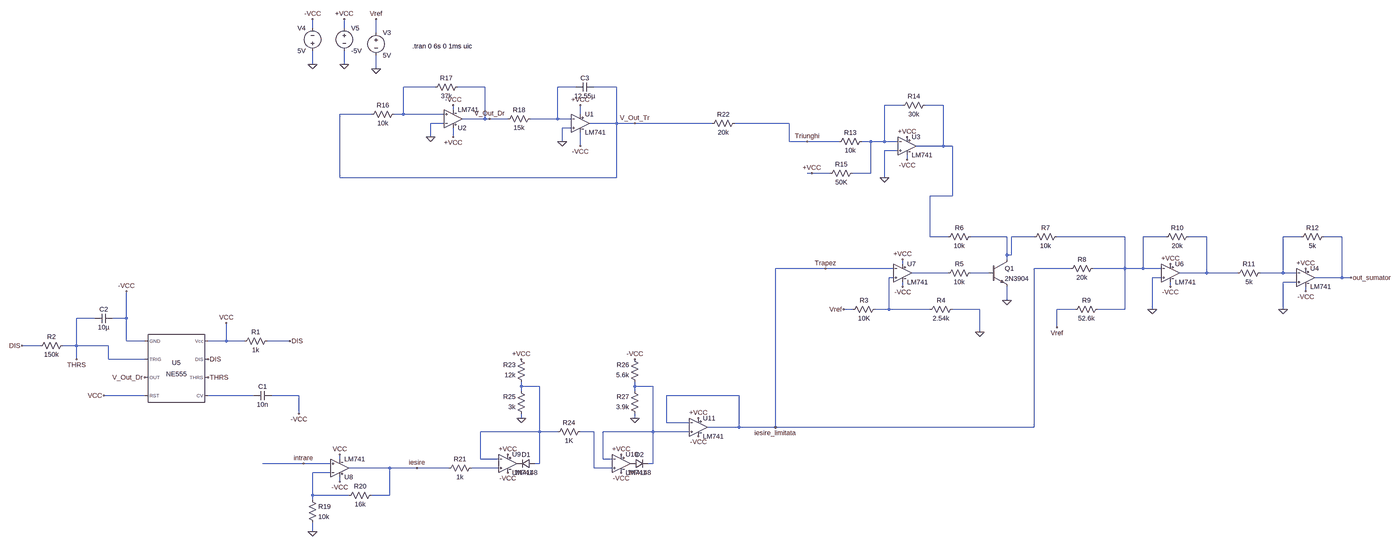
[diagram p0: schematic PROIECTSCIAIII_tot.asc, whole sheet]
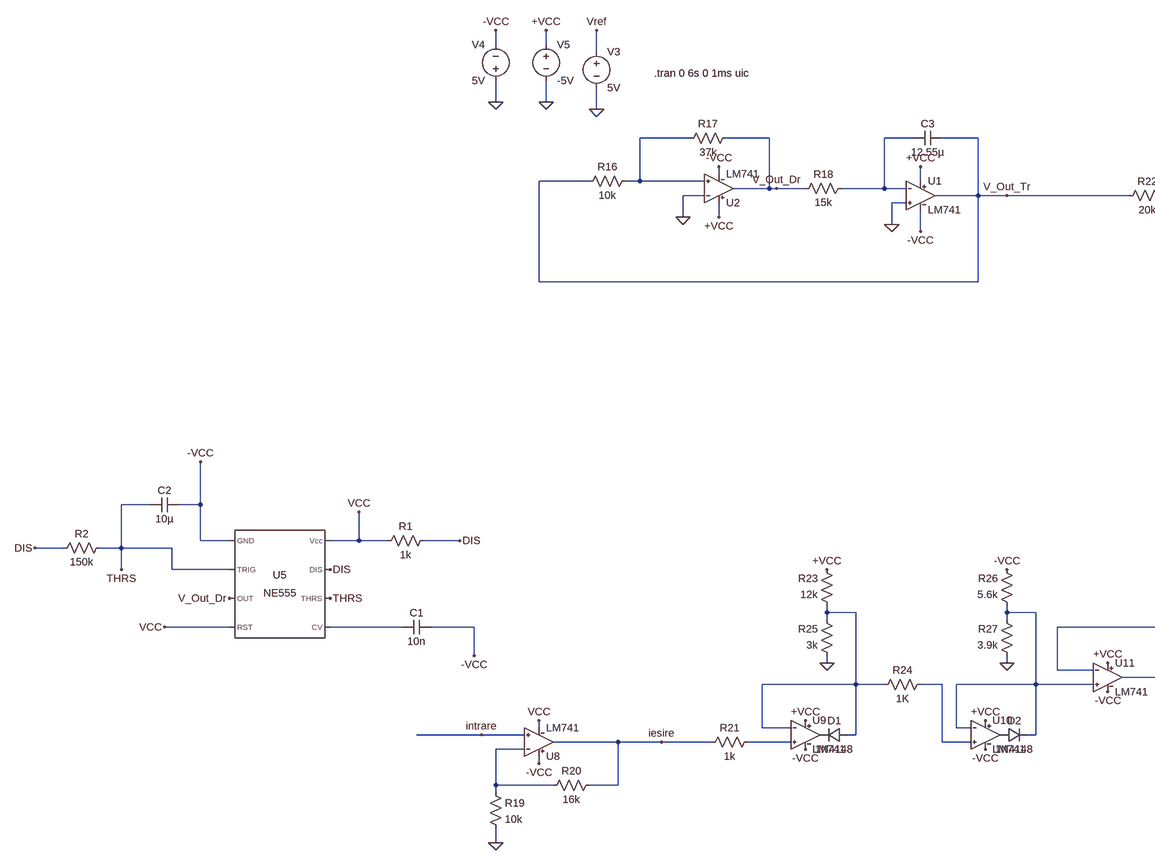
[diagram p1: schematic PROIECTSCIAIII_tot.asc, part, row 1 of 1, column 1 of 2]
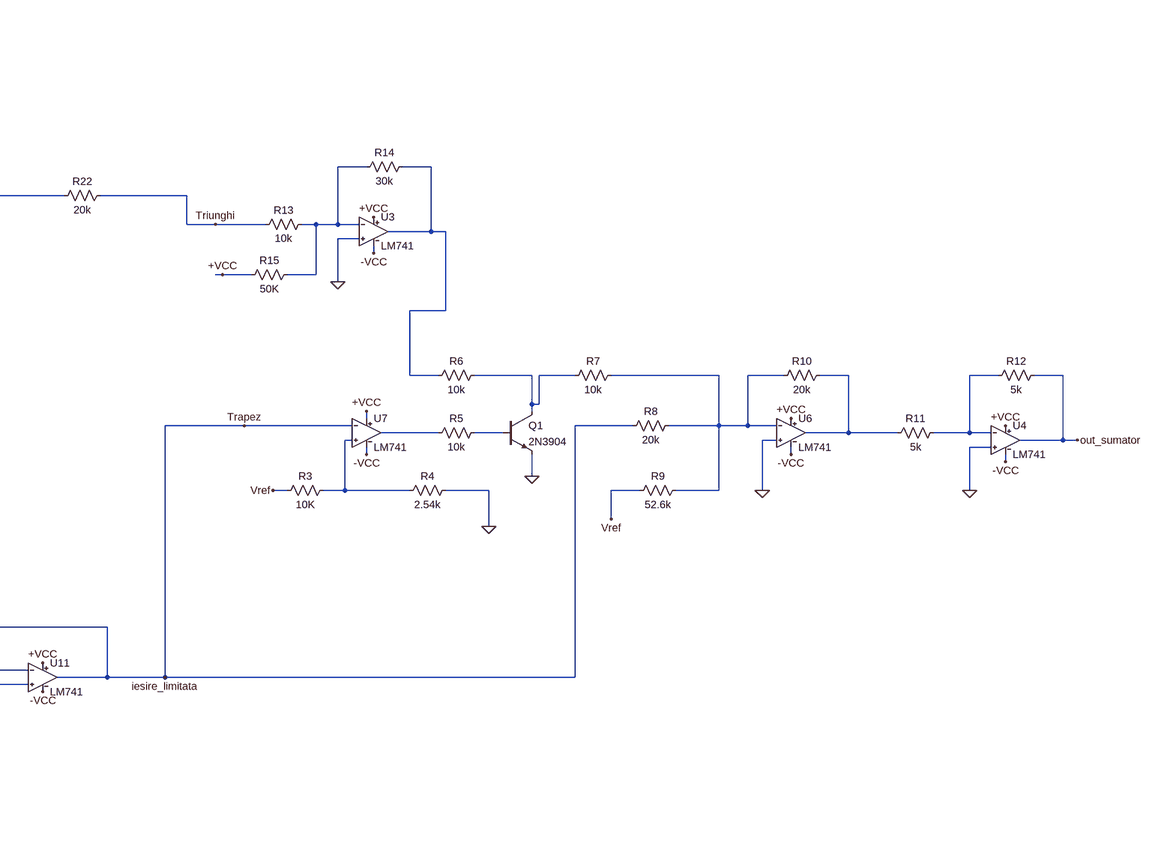
[diagram p2: schematic PROIECTSCIAIII_tot.asc, part, row 1 of 1, column 2 of 2]
PROIECTSCIAIII_tot.asc, the LTspice schematic file:
Version 4.1
SHEET 1 5364 2244
WIRE 1408 -1088 1408 -1120
WIRE 1520 -1088 1520 -1120
WIRE 1632 -1072 1632 -1120
WIRE 1408 -960 1408 -1008
WIRE 1520 -960 1520 -1008
WIRE 1632 -944 1632 -992
WIRE 1840 -880 1728 -880
WIRE 2016 -880 1920 -880
WIRE 2336 -880 2272 -880
WIRE 2480 -880 2400 -880
WIRE 3488 -816 3424 -816
WIRE 3632 -816 3568 -816
WIRE 1904 -800 1904 -816
WIRE 1616 -784 1504 -784
WIRE 1728 -784 1728 -880
WIRE 1728 -784 1696 -784
WIRE 1872 -784 1728 -784
WIRE 2352 -784 2352 -816
WIRE 2016 -768 2016 -880
WIRE 2016 -768 1936 -768
WIRE 2032 -768 2016 -768
WIRE 2096 -768 2032 -768
WIRE 2272 -768 2272 -880
WIRE 2272 -768 2176 -768
WIRE 2320 -768 2272 -768
WIRE 1872 -752 1824 -752
WIRE 2480 -752 2480 -880
WIRE 2480 -752 2384 -752
WIRE 2544 -752 2480 -752
WIRE 2816 -752 2544 -752
WIRE 3088 -752 2896 -752
WIRE 2320 -736 2288 -736
WIRE 1824 -704 1824 -752
WIRE 1904 -704 1904 -736
WIRE 2288 -688 2288 -736
WIRE 3088 -688 3088 -752
WIRE 3152 -688 3088 -688
WIRE 3264 -688 3152 -688
WIRE 3376 -688 3344 -688
WIRE 3424 -688 3424 -816
WIRE 3424 -688 3376 -688
WIRE 3472 -688 3424 -688
WIRE 2352 -672 2352 -720
WIRE 3632 -672 3632 -816
WIRE 3632 -672 3536 -672
WIRE 3664 -672 3632 -672
WIRE 3472 -656 3424 -656
WIRE 3504 -624 3504 -640
WIRE 3168 -576 3152 -576
WIRE 3232 -576 3168 -576
WIRE 3376 -576 3376 -688
WIRE 3376 -576 3312 -576
WIRE 1504 -560 1504 -784
WIRE 2480 -560 2480 -752
WIRE 2480 -560 1504 -560
WIRE 3424 -560 3424 -656
WIRE 3664 -496 3664 -672
WIRE 3664 -496 3584 -496
WIRE 3584 -352 3584 -496
WIRE 3648 -352 3584 -352
WIRE 3856 -352 3728 -352
WIRE 3952 -352 3872 -352
WIRE 4272 -352 4032 -352
WIRE 4416 -352 4336 -352
WIRE 4560 -352 4496 -352
WIRE 5008 -352 4944 -352
WIRE 5152 -352 5088 -352
WIRE 3856 -288 3856 -352
WIRE 3872 -288 3872 -352
WIRE 3872 -288 3856 -288
WIRE 3856 -272 3856 -288
WIRE 3488 -256 3488 -272
WIRE 3216 -240 3040 -240
WIRE 3456 -240 3216 -240
WIRE 4080 -240 3952 -240
WIRE 4272 -240 4272 -352
WIRE 4272 -240 4160 -240
WIRE 4336 -240 4336 -352
WIRE 4336 -240 4272 -240
WIRE 4400 -240 4336 -240
WIRE 3648 -224 3520 -224
WIRE 3792 -224 3728 -224
WIRE 4560 -224 4560 -352
WIRE 4560 -224 4464 -224
WIRE 4784 -224 4560 -224
WIRE 4944 -224 4944 -352
WIRE 4944 -224 4864 -224
WIRE 4992 -224 4944 -224
WIRE 3456 -208 3440 -208
WIRE 4400 -208 4368 -208
WIRE 5152 -208 5152 -352
WIRE 5152 -208 5056 -208
WIRE 5184 -208 5152 -208
WIRE 4992 -192 4944 -192
WIRE 3488 -176 3488 -192
WIRE 4432 -176 4432 -192
WIRE 5024 -160 5024 -176
WIRE 3856 -128 3856 -176
WIRE 3312 -96 3280 -96
WIRE 3440 -96 3440 -208
WIRE 3440 -96 3392 -96
WIRE 3584 -96 3440 -96
WIRE 3760 -96 3664 -96
WIRE 4096 -96 4032 -96
WIRE 4272 -96 4272 -240
WIRE 4272 -96 4176 -96
WIRE 4368 -96 4368 -208
WIRE 4944 -96 4944 -192
WIRE 640 -64 576 -64
WIRE 752 -64 752 -160
WIRE 752 -64 704 -64
WIRE 4032 -32 4032 -96
WIRE 3760 -16 3760 -96
WIRE 752 16 752 -64
WIRE 816 16 752 16
WIRE 1104 16 1104 -48
WIRE 1104 16 1040 16
WIRE 1168 16 1104 16
WIRE 1328 16 1248 16
WIRE 448 32 384 32
WIRE 576 32 576 -64
WIRE 576 32 528 32
WIRE 688 32 576 32
WIRE 576 80 576 32
WIRE 688 80 688 32
WIRE 816 80 688 80
WIRE 2144 176 2144 160
WIRE 2208 176 2144 176
WIRE 2544 176 2544 160
WIRE 2608 176 2544 176
WIRE 2144 192 2144 176
WIRE 2544 192 2544 176
WIRE 816 208 672 208
WIRE 1200 208 1040 208
WIRE 1360 208 1264 208
WIRE 2912 208 2656 208
WIRE 1360 272 1360 208
WIRE 2144 288 2144 272
WIRE 2544 288 2544 272
WIRE 2656 304 2656 208
WIRE 2736 304 2656 304
WIRE 2912 320 2912 208
WIRE 2912 320 2800 320
WIRE 3040 320 3040 -240
WIRE 3040 320 2912 320
WIRE 3952 320 3952 -240
WIRE 3952 320 3040 320
WIRE 2208 336 2208 176
WIRE 2208 336 2000 336
WIRE 2272 336 2208 336
WIRE 2400 336 2352 336
WIRE 2608 336 2608 176
WIRE 2608 336 2432 336
WIRE 2736 336 2608 336
WIRE 1504 432 1504 416
WIRE 2000 432 2000 336
WIRE 2064 432 2000 432
WIRE 2432 432 2432 336
WIRE 2464 432 2432 432
WIRE 1376 448 1232 448
WIRE 1472 448 1376 448
WIRE 2208 448 2208 336
WIRE 2208 448 2192 448
WIRE 2608 448 2608 336
WIRE 2608 448 2592 448
WIRE 1680 464 1536 464
WIRE 1776 464 1680 464
WIRE 1888 464 1776 464
WIRE 2064 464 1968 464
WIRE 2400 464 2400 336
WIRE 2464 464 2400 464
WIRE 1472 480 1408 480
WIRE 1504 512 1504 496
WIRE 1408 560 1408 480
WIRE 1536 560 1408 560
WIRE 1680 560 1680 464
WIRE 1680 560 1616 560
WIRE 1408 576 1408 560
WIRE 1408 688 1408 656
FLAG 1360 272 -VCC
FLAG 672 208 VCC
FLAG 816 144 V_Out_Dr
FLAG 1040 80 DIS
FLAG 1040 144 THRS
FLAG 1328 16 DIS
FLAG 1104 -48 VCC
FLAG 384 32 DIS
FLAG 576 80 THRS
FLAG 3760 -16 0
FLAG 3856 -128 0
FLAG 3488 -272 +VCC
FLAG 3488 -176 -VCC
FLAG 4368 -96 0
FLAG 4944 -96 0
FLAG 4432 -176 -VCC
FLAG 4432 -256 +VCC
FLAG 5024 -240 +VCC
FLAG 5024 -160 -VCC
FLAG 3280 -96 Vref
FLAG 1632 -1120 Vref
FLAG 1632 -944 0
FLAG 1408 -960 0
FLAG 1408 -1120 -VCC
FLAG 1520 -960 0
FLAG 1520 -1120 +VCC
FLAG 3216 -240 Trapez
FLAG 5184 -208 out_sumator
FLAG 3424 -560 0
FLAG 3504 -704 +VCC
FLAG 3504 -624 -VCC
FLAG 3168 -576 +VCC
FLAG 1824 -704 0
FLAG 2288 -688 0
FLAG 1904 -704 +VCC
FLAG 1904 -816 -VCC
FLAG 2544 -752 V_Out_Tr
FLAG 2032 -768 V_Out_Dr
FLAG 2352 -672 -VCC
FLAG 2352 -816 +VCC
FLAG 3040 320 iesire_limitata
FLAG 1504 416 VCC
FLAG 1504 512 -VCC
FLAG 1376 448 intrare
FLAG 1408 688 0
FLAG 3152 -688 Triunghi
FLAG 4032 -32 Vref
FLAG 2096 416 +VCC
FLAG 2096 480 -VCC
FLAG 2496 416 +VCC
FLAG 2496 480 -VCC
FLAG 2144 288 0
FLAG 2144 80 +VCC
FLAG 2544 288 0
FLAG 2544 80 -VCC
FLAG 1776 464 iesire
FLAG 2768 288 +VCC
FLAG 2768 352 -VCC
FLAG 752 -160 -VCC
SYMBOL Misc\\NE555 928 112 R0
SYMATTR InstName U5
SYMBOL cap 1264 192 R90
WINDOW 0 0 32 VBottom 2
WINDOW 3 32 32 VTop 2
SYMATTR InstName C1
SYMATTR Value 10n
SYMBOL res 1264 0 R90
WINDOW 0 0 56 VBottom 2
WINDOW 3 32 56 VTop 2
SYMATTR InstName R1
SYMATTR Value 1k
SYMBOL cap 704 -80 R90
WINDOW 0 0 32 VBottom 2
WINDOW 3 32 32 VTop 2
SYMATTR InstName C2
SYMATTR Value 10µ
SYMBOL res 544 16 R90
WINDOW 0 0 56 VBottom 2
WINDOW 3 32 56 VTop 2
SYMATTR InstName R2
SYMATTR Value 150k
SYMBOL res 3408 -112 R90
WINDOW 0 0 56 VBottom 2
WINDOW 3 32 56 VTop 2
SYMATTR InstName R3
SYMATTR Value 10K
SYMBOL res 3680 -112 R90
WINDOW 0 0 56 VBottom 2
WINDOW 3 32 56 VTop 2
SYMATTR InstName R4
SYMATTR Value 2.54k
SYMBOL res 3744 -240 R90
WINDOW 0 0 56 VBottom 2
WINDOW 3 32 56 VTop 2
SYMATTR InstName R5
SYMATTR Value 10k
SYMBOL res 3744 -368 R90
WINDOW 0 0 56 VBottom 2
WINDOW 3 32 56 VTop 2
SYMATTR InstName R6
SYMATTR Value 10k
SYMBOL npn 3792 -272 R0
SYMATTR InstName Q1
SYMATTR Value 2N3904
SYMBOL res 3936 -336 R270
WINDOW 0 32 56 VTop 2
WINDOW 3 0 56 VBottom 2
SYMATTR InstName R7
SYMATTR Value 10k
SYMBOL res 4064 -224 R270
WINDOW 0 32 56 VTop 2
WINDOW 3 0 56 VBottom 2
SYMATTR InstName R8
SYMATTR Value 20k
SYMBOL res 4080 -80 R270
WINDOW 0 32 56 VTop 2
WINDOW 3 0 56 VBottom 2
SYMATTR InstName R9
SYMATTR Value 52.6k
SYMBOL res 4512 -368 R90
WINDOW 0 0 56 VBottom 2
WINDOW 3 32 56 VTop 2
SYMATTR InstName R10
SYMATTR Value 20k
SYMBOL res 4880 -240 R90
WINDOW 0 0 56 VBottom 2
WINDOW 3 32 56 VTop 2
SYMATTR InstName R11
SYMATTR Value 5k
SYMBOL res 5104 -368 R90
WINDOW 0 0 56 VBottom 2
WINDOW 3 32 56 VTop 2
SYMATTR InstName R12
SYMATTR Value 5k
SYMBOL voltage 1632 -1088 R0
SYMATTR InstName V3
SYMATTR Value 5V
SYMBOL voltage 1408 -992 R180
WINDOW 0 24 96 Left 2
WINDOW 3 24 16 Left 2
SYMATTR InstName V4
SYMATTR Value 5V
SYMBOL voltage 1520 -1104 R0
SYMATTR InstName V5
SYMATTR Value -5V
SYMBOL res 3360 -704 R90
WINDOW 0 0 56 VBottom 2
WINDOW 3 32 56 VTop 2
SYMATTR InstName R13
SYMATTR Value 10k
SYMBOL res 3584 -832 R90
WINDOW 0 0 56 VBottom 2
WINDOW 3 32 56 VTop 2
SYMATTR InstName R14
SYMATTR Value 30k
SYMBOL res 3328 -592 R90
WINDOW 0 0 56 VBottom 2
WINDOW 3 32 56 VTop 2
SYMATTR InstName R15
SYMATTR Value 50K
SYMBOL res 1712 -800 R90
WINDOW 0 0 56 VBottom 2
WINDOW 3 32 56 VTop 2
SYMATTR InstName R16
SYMATTR Value 10k
SYMBOL res 1936 -896 R90
WINDOW 0 0 56 VBottom 2
WINDOW 3 32 56 VTop 2
SYMATTR InstName R17
SYMATTR Value 37k
SYMBOL res 2192 -784 R90
WINDOW 0 0 56 VBottom 2
WINDOW 3 32 56 VTop 2
SYMATTR InstName R18
SYMATTR Value 15k
SYMBOL cap 2400 -896 R90
WINDOW 0 0 32 VBottom 2
WINDOW 3 32 32 VTop 2
SYMATTR InstName C3
SYMATTR Value 12.55µ
SYMBOL res 1392 560 R0
SYMATTR InstName R19
SYMATTR Value 10k
SYMBOL res 1632 544 R90
WINDOW 0 0 56 VBottom 2
WINDOW 3 32 56 VTop 2
SYMATTR InstName R20
SYMATTR Value 16k
SYMBOL res 1872 480 R270
WINDOW 0 32 56 VTop 2
WINDOW 3 0 56 VBottom 2
SYMATTR InstName R21
SYMATTR Value 1k
SYMBOL res 2912 -768 R90
WINDOW 0 0 56 VBottom 2
WINDOW 3 32 56 VTop 2
SYMATTR InstName R22
SYMATTR Value 20k
SYMBOL LM741 2352 -816 R0
SYMATTR InstName U1
SYMBOL LM741 1904 -704 M180
SYMATTR InstName U2
SYMBOL LM741 3504 -736 R0
SYMATTR InstName U3
SYMBOL LM741 5024 -272 R0
SYMATTR InstName U4
SYMBOL LM741 4432 -288 R0
SYMATTR InstName U6
SYMBOL LM741 3488 -288 R0
SYMATTR InstName U7
SYMBOL LM741 1504 528 M180
SYMATTR InstName U8
SYMBOL LM741 2096 384 R0
SYMATTR InstName U9
SYMBOL diode 2192 432 R90
WINDOW 0 0 32 VBottom 2
WINDOW 3 32 32 VTop 2
SYMATTR InstName D1
SYMATTR Value 1N4148
SYMBOL LM741 2496 384 R0
SYMATTR InstName U10
SYMBOL diode 2528 464 R270
WINDOW 0 32 32 VTop 2
WINDOW 3 0 32 VBottom 2
SYMATTR InstName D2
SYMATTR Value 1N4148
SYMBOL res 2160 176 R180
WINDOW 0 36 76 Left 2
WINDOW 3 36 40 Left 2
SYMATTR InstName R23
SYMATTR Value 12k
SYMBOL res 2368 320 R90
WINDOW 0 0 56 VBottom 2
WINDOW 3 32 56 VTop 2
SYMATTR InstName R24
SYMATTR Value 1K
SYMBOL res 2160 288 R180
WINDOW 0 36 76 Left 2
WINDOW 3 36 40 Left 2
SYMATTR InstName R25
SYMATTR Value 3k
SYMBOL res 2560 176 R180
WINDOW 0 36 76 Left 2
WINDOW 3 36 40 Left 2
SYMATTR InstName R26
SYMATTR Value 5.6k
SYMBOL res 2560 288 R180
WINDOW 0 36 76 Left 2
WINDOW 3 36 40 Left 2
SYMATTR InstName R27
SYMATTR Value 3.9k
SYMBOL LM741 2768 256 R0
SYMATTR InstName U11
TEXT 1760 -1024 Left 2 !.tran 0 6s 0 1ms uic

The netlist it stands for:
* PROIECTSCIAIII_tot.asc
X§U5 -VCC THRS V_Out_Dr VCC N014 THRS DIS VCC NE555  ; pins GND TRIG OUT RST CV THRS DIS Vcc
C1 -VCC N014 10n
R1 DIS VCC 1k
C2 -VCC THRS 10µ
R2 THRS DIS 150k
R3 N011 Vref 10K
R4 0 N011 2.54k
R5 N010 N009 10k
R6 N005 N004 10k
Q1 N005 N010 0 0 2N3904
R7 N005 N006 10k
R8 iesire_limitata N006 20k
R9 Vref N006 52.6k
R10 N007 N006 20k
R11 N008 N007 5k
R12 out_sumator N008 5k
V3 Vref 0 5V
V4 0 -VCC 5V
V5 +VCC 0 -5V
R13 N003 Triunghi 10k
R14 N004 N003 30k
R15 N003 +VCC 50K
R16 N001 V_Out_Tr 10k
R17 V_Out_Dr N001 37k
R18 N002 V_Out_Dr 15k
C3 V_Out_Tr N002 12.55µ
R19 N017 0 10k
R20 iesire N017 16k
R21 iesire N016 1k
R22 Triunghi V_Out_Tr 20k
X§U1 0 N002 +VCC -VCC V_Out_Tr LM741  ; pins In+ In- V+ V- OUT
X§U2 N001 0 +VCC -VCC V_Out_Dr LM741  ; pins In+ In- V+ V- OUT
X§U3 0 N003 +VCC -VCC N004 LM741  ; pins In+ In- V+ V- OUT
X§U4 0 N008 +VCC -VCC out_sumator LM741  ; pins In+ In- V+ V- OUT
X§U6 0 N006 +VCC -VCC N007 LM741  ; pins In+ In- V+ V- OUT
X§U7 N011 iesire_limitata +VCC -VCC N009 LM741  ; pins In+ In- V+ V- OUT
X§U8 intrare N017 -VCC VCC iesire LM741  ; pins In+ In- V+ V- OUT
X§U9 N016 N012 +VCC -VCC P001 LM741  ; pins In+ In- V+ V- OUT
D1 N012 P001 1N4148
X§U10 N015 N013 +VCC -VCC P002 LM741  ; pins In+ In- V+ V- OUT
D2 P002 N013 1N4148
R23 N012 +VCC 12k
R24 N015 N012 1K
R25 0 N012 3k
R26 N013 -VCC 5.6k
R27 0 N013 3.9k
X§U11 N013 iesire_limitata +VCC -VCC iesire_limitata LM741  ; pins In+ In- V+ V- OUT
.model D D
.lib standard.dio
.model NPN NPN
.model PNP PNP
.lib standard.bjt
.tran 0 6s 0 1ms uic
.lib NE555.sub
.lib LM741.lib
.backanno
.end